# EAGLE schematic A10S-OLinuXino-MICRO_Rev_A (EAGLE 4.16)
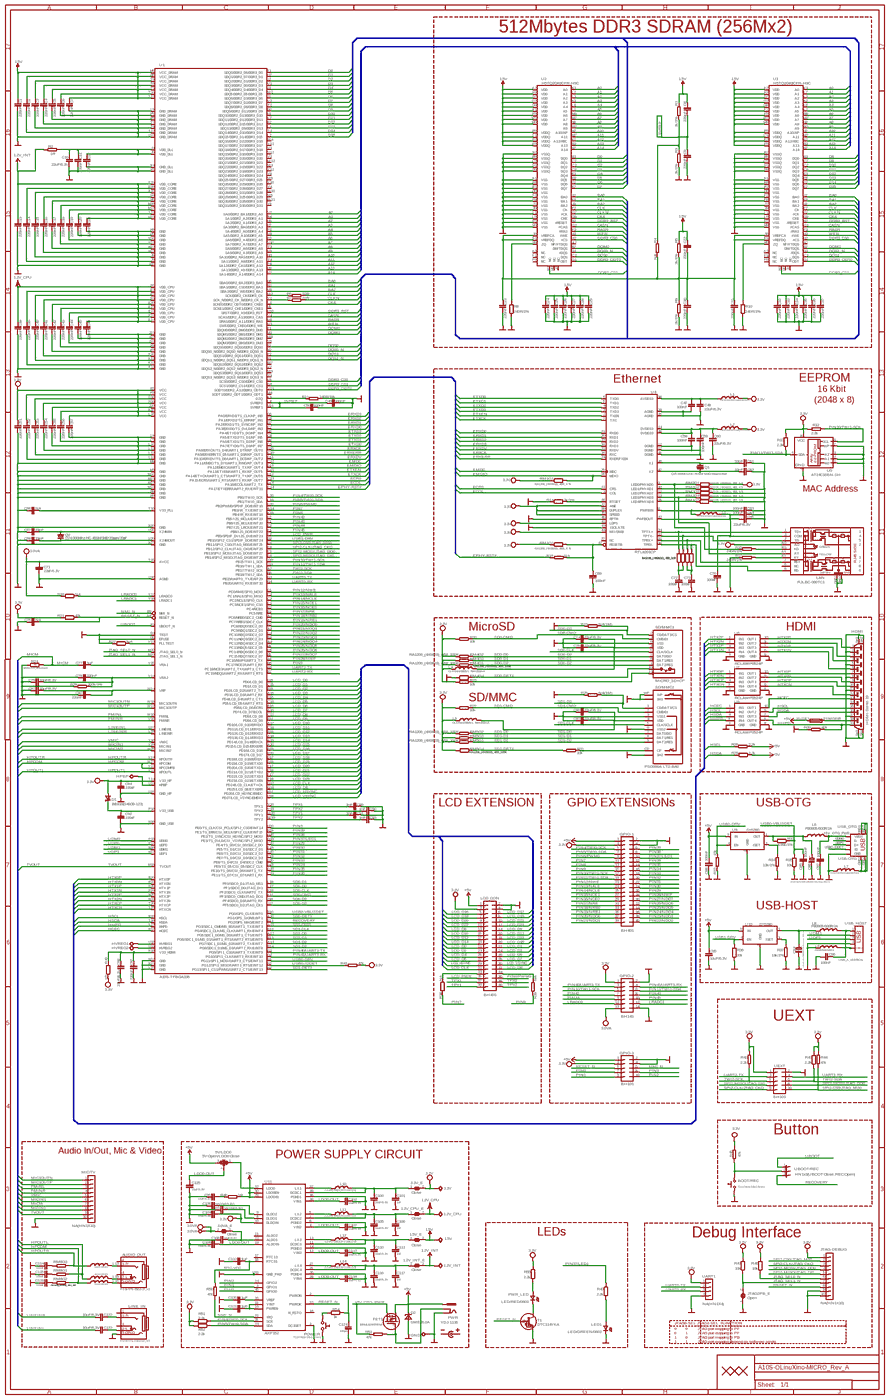
[diagram p0: schematic, sheet 1, overview]
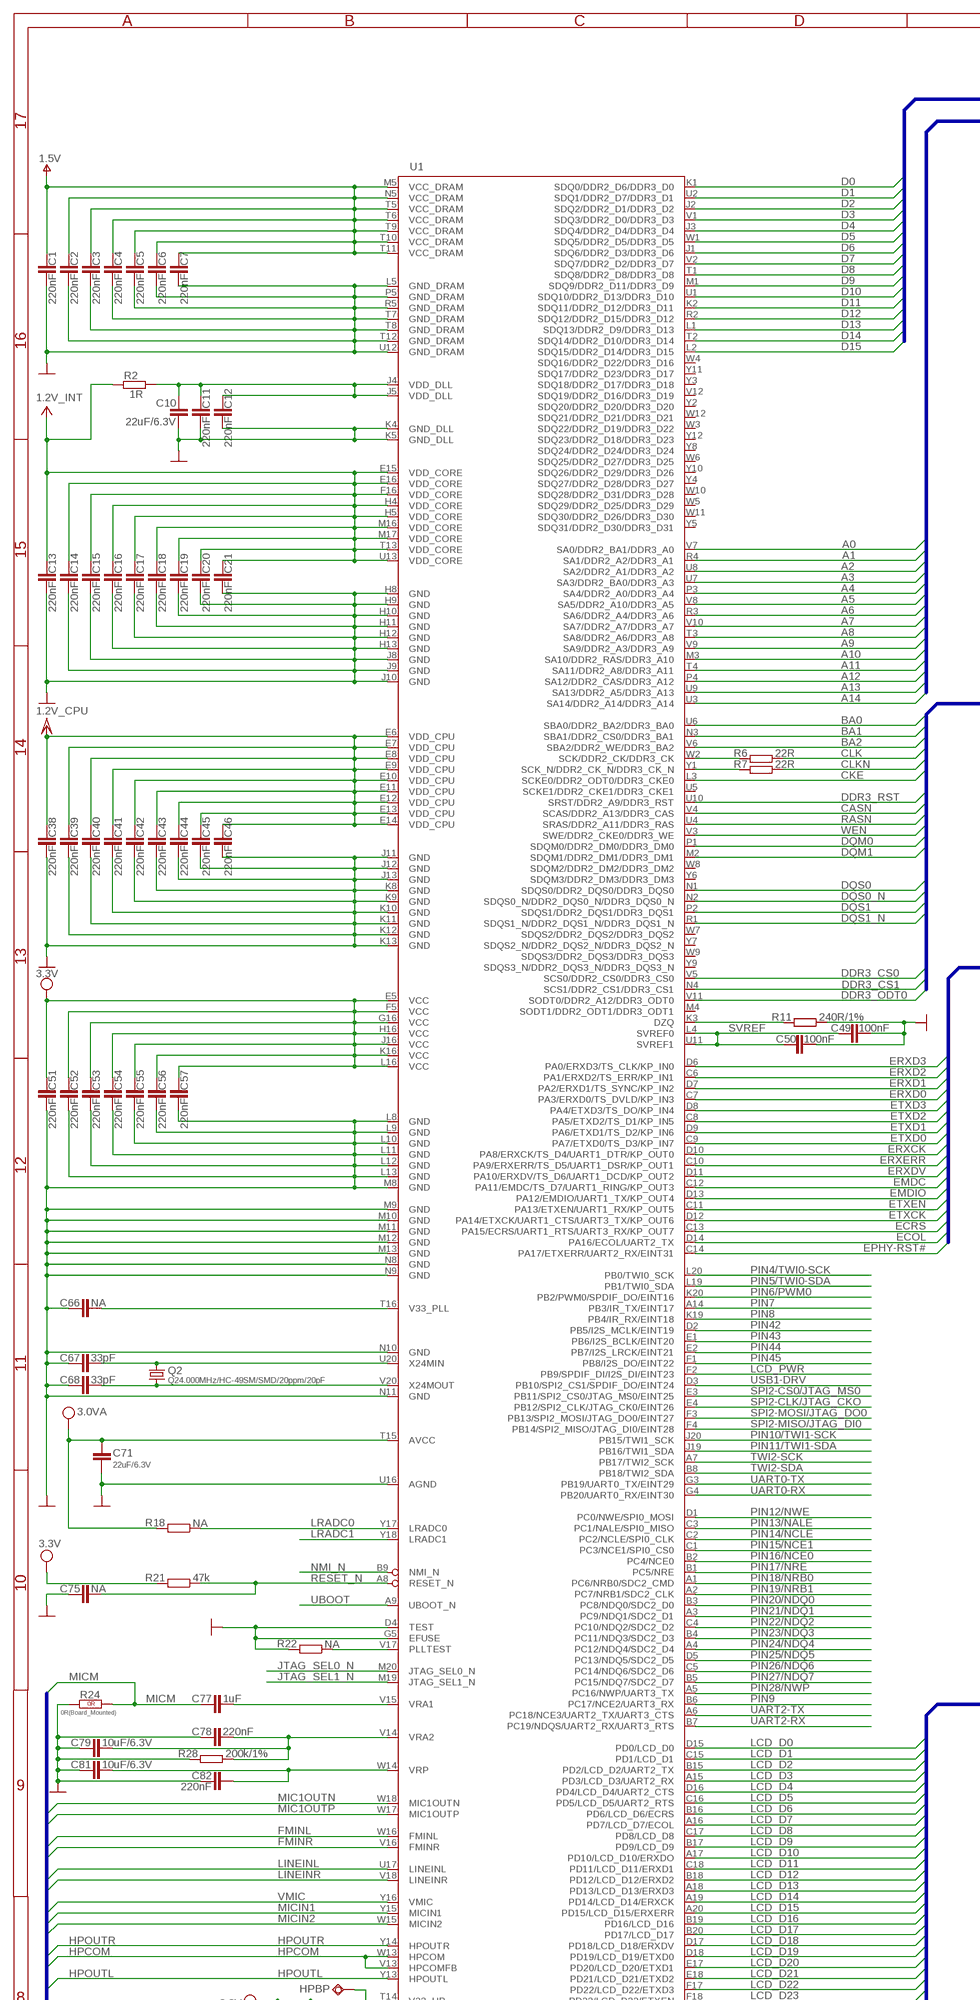
[diagram p1: schematic, sheet 1, part 1 of 4]
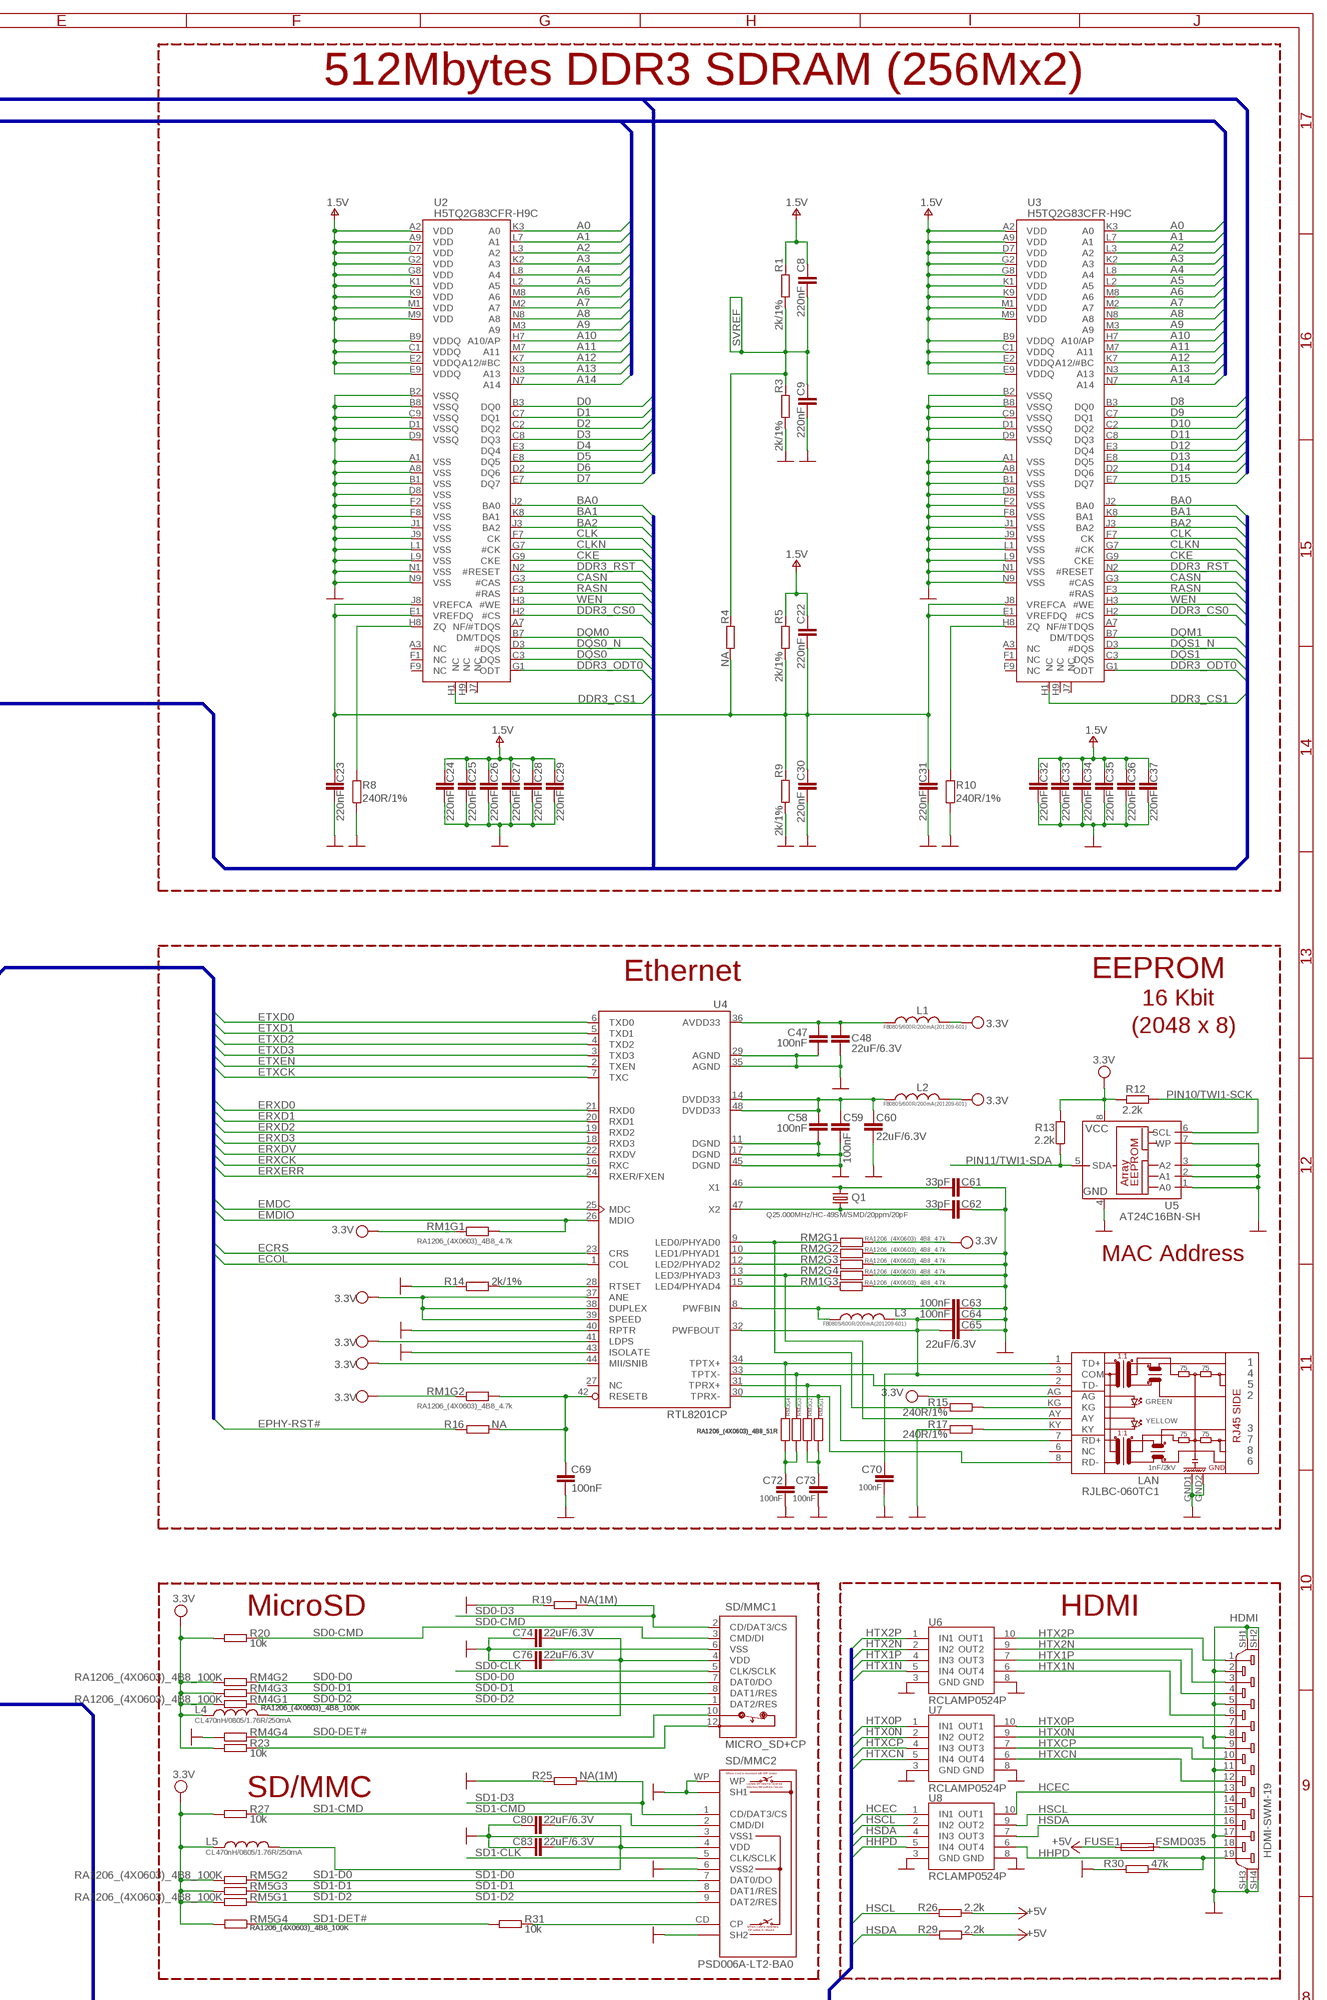
[diagram p2: schematic, sheet 1, part 2 of 4]
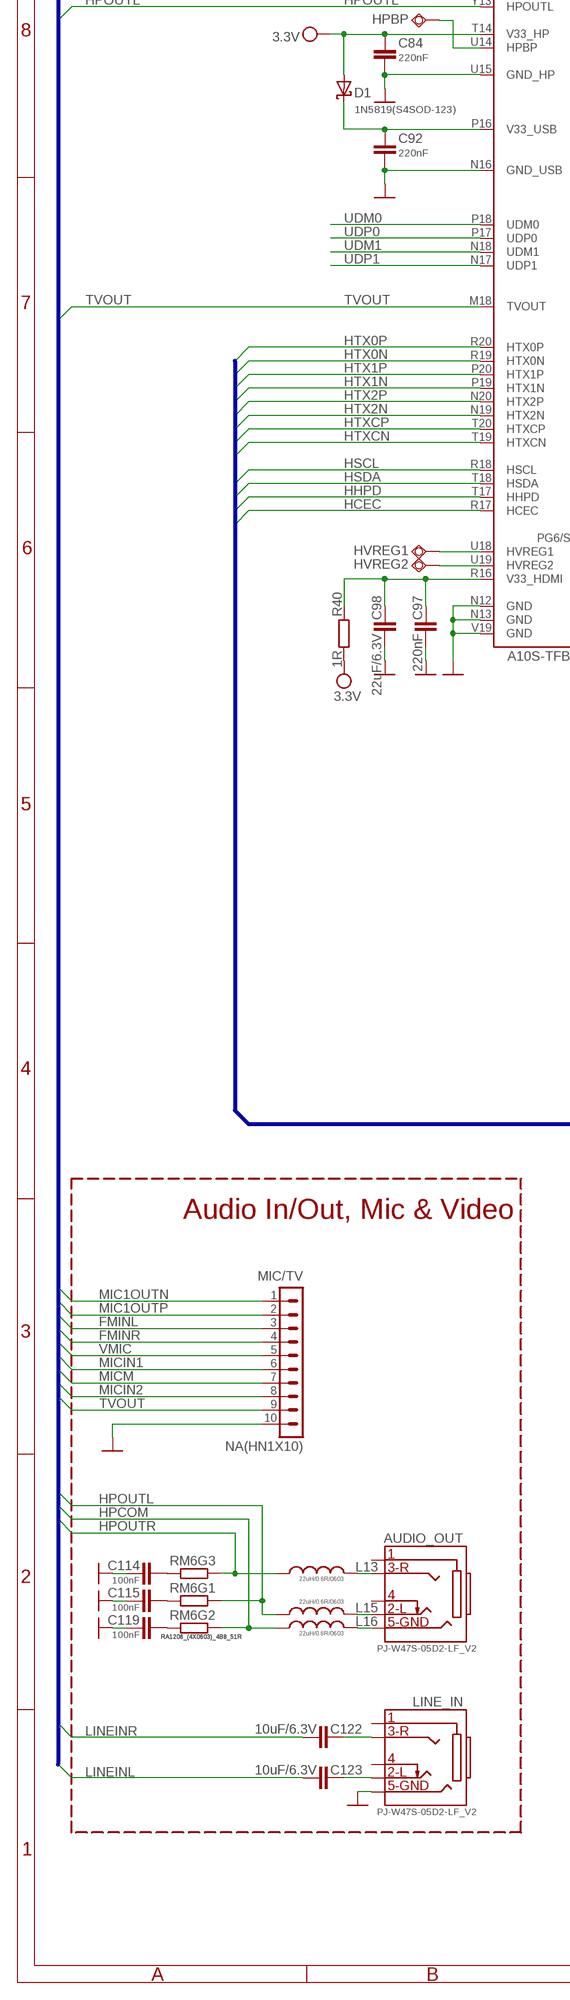
[diagram p3: schematic, sheet 1, part 3 of 4]
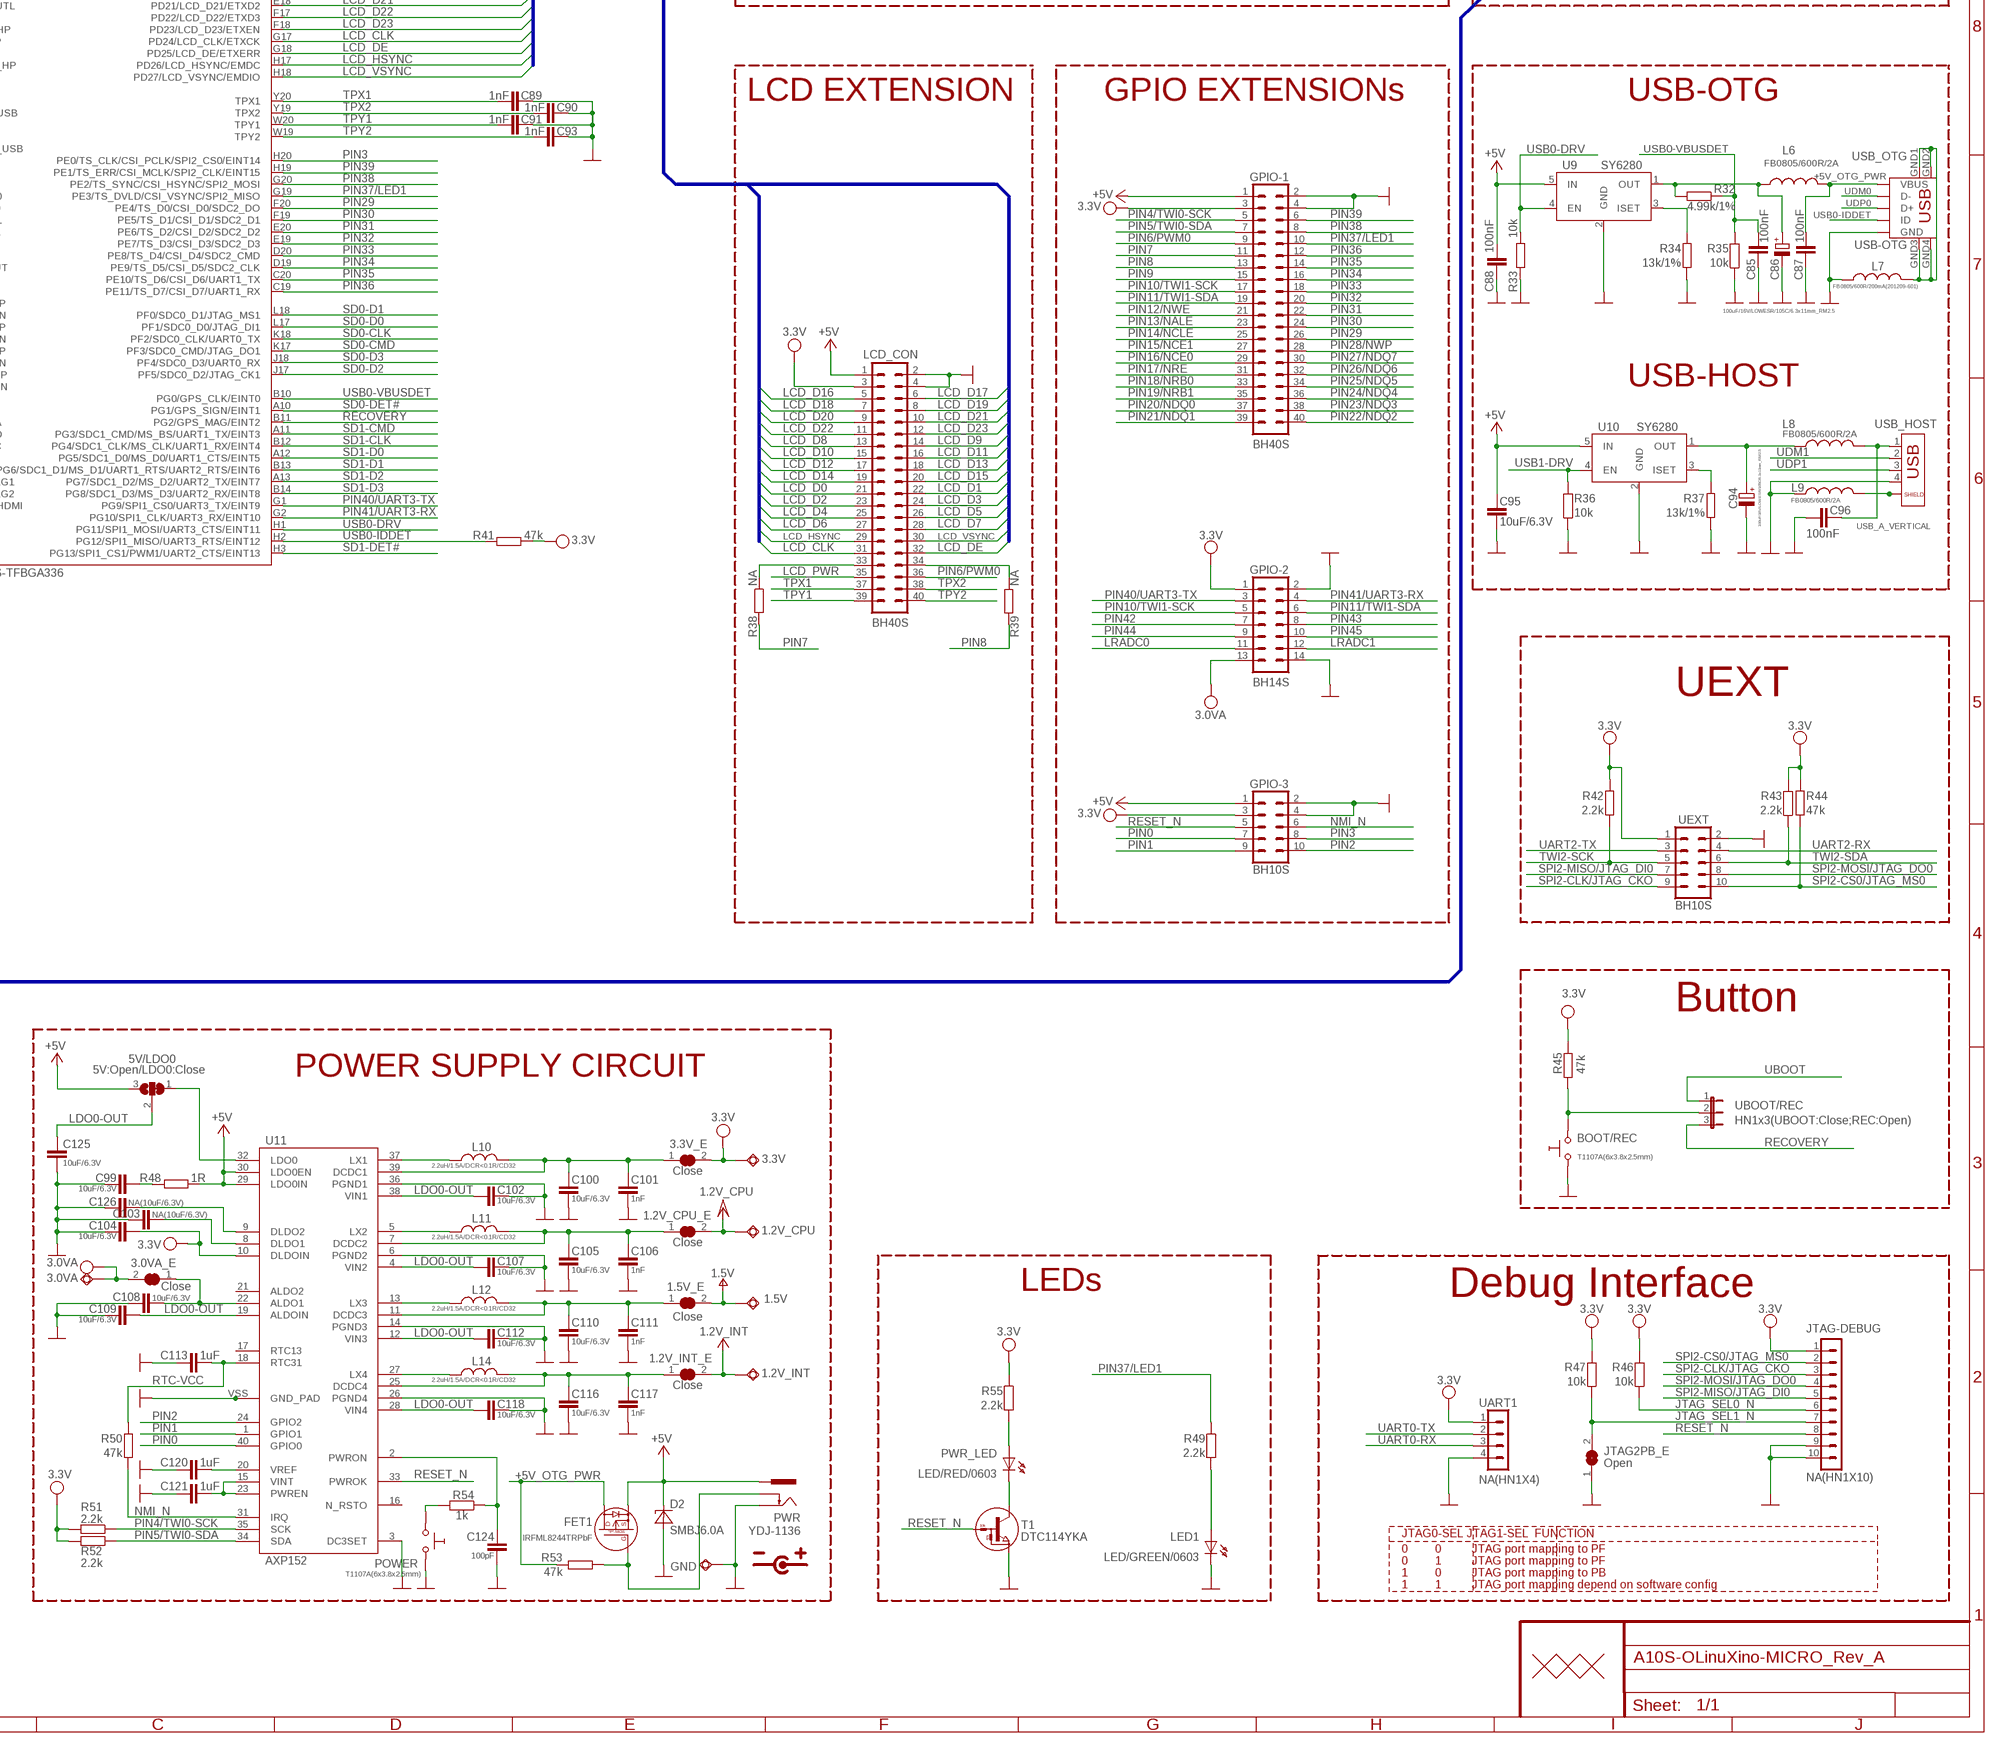
[diagram p4: schematic, sheet 1, part 4 of 4]

## Parts
1.2V_CPU  TESTPADTESTPAD_40-ROUND  [TESTPAD_40-ROUND]
1.2V_CPU_E  Close  SJSJ_1_SMALLER_CLOSE  [SJ_1_SMALLER_CLOSE]
1.2V_INT  TESTPADTESTPAD_40-ROUND  [TESTPAD_40-ROUND]
1.2V_INT_E  Close  SJSJ_1_SMALLER_CLOSE  [SJ_1_SMALLER_CLOSE]
1.5V  TESTPADTESTPAD_40-ROUND  [TESTPAD_40-ROUND]
1.5V_E  Close  SJSJ_1_SMALLER_CLOSE  [SJ_1_SMALLER_CLOSE]
3.0VA  TESTPADTESTPAD_40-ROUND  [TESTPAD_40-ROUND]
3.0VA_E  Close  SJSJ_1_SMALLER_CLOSE  [SJ_1_SMALLER_CLOSE]
3.3V  TESTPADTESTPAD_40-ROUND  [TESTPAD_40-ROUND]
3.3V_E  Close  SJSJ_1_SMALLER_CLOSE  [SJ_1_SMALLER_CLOSE]
5V/LDO0  5V:Open/LDO0:Close  SJ2W6  [SJ_2_SMALL_12_TIED]
AUDIO_OUT  PJ-W47S-05D2-LF_V2  AUDIO_JACK_5PINPJ-W47S-05D2-LF_V2  [PJ-W47S-05D2-LF_5PIN_V2]
BOOT/REC  T1107A(6x3.8x2.5mm)  SW-TAKT6  [SW-TAKT_6X3.5_SMD]
C1  220nF  C-EUC0603_DWS  [C0603_DWS]
C2  220nF  C-EUC0603_DWS  [C0603_DWS]
C3  220nF  C-EUC0603_DWS  [C0603_DWS]
C4  220nF  C-EUC0603_DWS  [C0603_DWS]
C5  220nF  C-EUC0603_DWS  [C0603_DWS]
C6  220nF  C-EUC0603_DWS  [C0603_DWS]
C7  220nF  C-EUC0603_DWS  [C0603_DWS]
C8  220nF  C-EUC0603_DWS  [C0603_DWS]
C9  220nF  C-EUC0603_DWS  [C0603_DWS]
C10  22uF/6.3V  C-EUC0603_DWS  [C0603_DWS]
C11  220nF  C-EUC0603_DWS  [C0603_DWS]
C12  220nF  C-EUC0603_DWS  [C0603_DWS]
C13  220nF  C-EUC0603_DWS  [C0603_DWS]
C14  220nF  C-EUC0603_DWS  [C0603_DWS]
C15  220nF  C-EUC0603_DWS  [C0603_DWS]
C16  220nF  C-EUC0603_DWS  [C0603_DWS]
C17  220nF  C-EUC0603_DWS  [C0603_DWS]
C18  220nF  C-EUC0603_DWS  [C0603_DWS]
C19  220nF  C-EUC0603_DWS  [C0603_DWS]
C20  220nF  C-EUC0603_DWS  [C0603_DWS]
C21  220nF  C-EUC0603_DWS  [C0603_DWS]
C22  220nF  C-EUC0603_DWS  [C0603_DWS]
C23  220nF  C-EUC0603_DWS  [C0603_DWS]
C24  220nF  C-EUC0603_DWS  [C0603_DWS]
C25  220nF  C-EUC0603_DWS  [C0603_DWS]
C26  220nF  C-EUC0603_DWS  [C0603_DWS]
C27  220nF  C-EUC0603_DWS  [C0603_DWS]
C28  220nF  C-EUC0603_DWS  [C0603_DWS]
C29  220nF  C-EUC0603_DWS  [C0603_DWS]
C30  220nF  C-EUC0603_DWS  [C0603_DWS]
C31  220nF  C-EUC0603_DWS  [C0603_DWS]
C32  220nF  C-EUC0603_DWS  [C0603_DWS]
C33  220nF  C-EUC0603_DWS  [C0603_DWS]
C34  220nF  C-EUC0603_DWS  [C0603_DWS]
C35  220nF  C-EUC0603_DWS  [C0603_DWS]
C36  220nF  C-EUC0603_DWS  [C0603_DWS]
C37  220nF  C-EUC0603_DWS  [C0603_DWS]
C38  220nF  C-EUC0603_DWS  [C0603_DWS]
C39  220nF  C-EUC0603_DWS  [C0603_DWS]
C40  220nF  C-EUC0603_DWS  [C0603_DWS]
C41  220nF  C-EUC0603_DWS  [C0603_DWS]
C42  220nF  C-EUC0603_DWS  [C0603_DWS]
C43  220nF  C-EUC0603_DWS  [C0603_DWS]
C44  220nF  C-EUC0603_DWS  [C0603_DWS]
C45  220nF  C-EUC0603_DWS  [C0603_DWS]
C46  220nF  C-EUC0603_DWS  [C0603_DWS]
C47  100nF  C-EUC0603_DWS  [C0603_DWS]
C48  22uF/6.3V  C-EUC0603_DWS  [C0603_DWS]
C49  100nF  C-EUC0603_DWS  [C0603_DWS]
C50  100nF  C-EUC0603_DWS  [C0603_DWS]
C51  220nF  C-EUC0603_DWS  [C0603_DWS]
C52  220nF  C-EUC0603_DWS  [C0603_DWS]
C53  220nF  C-EUC0603_DWS  [C0603_DWS]
C54  220nF  C-EUC0603_DWS  [C0603_DWS]
C55  220nF  C-EUC0603_DWS  [C0603_DWS]
C56  220nF  C-EUC0603_DWS  [C0603_DWS]
C57  220nF  C-EUC0603_DWS  [C0603_DWS]
C58  100nF  C-EUC0603_DWS  [C0603_DWS]
C59  100nF  C-EUC0603_DWS  [C0603_DWS]
C60  22uF/6.3V  C-EUC0603_DWS  [C0603_DWS]
C61  33pF  C-EUC0603_DWS  [C0603_DWS]
C62  33pF  C-EUC0603_DWS  [C0603_DWS]
C63  100nF  C-EUC0603_DWS  [C0603_DWS]
C64  100nF  C-EUC0603_DWS  [C0603_DWS]
C65  22uF/6.3V  C-EUC0603_DWS  [C0603_DWS]
C66  NA  C-EUC0603_DWS  [C0603_DWS]
C67  33pF  C-EUC0603_DWS  [C0603_DWS]
C68  33pF  C-EUC0603_DWS  [C0603_DWS]
C69  100nF  C-EUC0603_DWS  [C0603_DWS]
C70  100nF  C-EUC0603_DWS  [C0603_DWS]
C71  22uF/6.3V  C-EUC0603_DWS  [C0603_DWS]
C72  100nF  C-EUC0603_DWS  [C0603_DWS]
C73  100nF  C-EUC0603_DWS  [C0603_DWS]
C74  22uF/6.3V  C-EUC0603_DWS  [C0603_DWS]
C75  NA  C-EUC0603_DWS  [C0603_DWS]
C76  22uF/6.3V  C-EUC0603_DWS  [C0603_DWS]
C77  1uF  C-EUC0603_DWS  [C0603_DWS]
C78  220nF  C-EUC0603_DWS  [C0603_DWS]
C79  10uF/6.3V  C-EUC0603_DWS  [C0603_DWS]
C80  22uF/6.3V  C-EUC0603_DWS  [C0603_DWS]
C81  10uF/6.3V  C-EUC0603_DWS  [C0603_DWS]
C82  220nF  C-EUC0603_DWS  [C0603_DWS]
C83  22uF/6.3V  C-EUC0603_DWS  [C0603_DWS]
C84  220nF  C-EUC0603_DWS  [C0603_DWS]
C85  100nF  C-EUC0603_DWS  [C0603_DWS]
C86  100uF/16V/LOWESR/105C/6.3x11mm_RM2.5  CPOL-EUE2.5-6.3  [E2,5-6,3]
C87  100nF  C-EUC0603_DWS  [C0603_DWS]
C88  100nF  C-EUC0603_DWS  [C0603_DWS]
C89  1nF  C-EUC0603_DWS  [C0603_DWS]
C90  1nF  C-EUC0603_DWS  [C0603_DWS]
C91  1nF  C-EUC0603_DWS  [C0603_DWS]
C92  220nF  C-EUC0603_DWS  [C0603_DWS]
C93  1nF  C-EUC0603_DWS  [C0603_DWS]
C94  100uF/16V/LOWESR/105C/6.3x11mm_RM2.5  CPOL-EUE2.5-6.3  [E2,5-6,3]
C95  10uF/6.3V  C-EUC0603_DWS  [C0603_DWS]
C96  100nF  C-EUC0603_DWS  [C0603_DWS]
C97  220nF  C-EUC0603_DWS  [C0603_DWS]
C98  22uF/6.3V  C-EUC0603_DWS  [C0603_DWS]
C99  10uF/6.3V  C-EUC0603_DWS  [C0603_DWS]
C100  10uF/6.3V  C-EUC0603_DWS  [C0603_DWS]
C101  1nF  C-EUC0603_DWS  [C0603_DWS]
C102  10uF/6.3V  C-EUC0603_DWS  [C0603_DWS]
C103  NA(10uF/6.3V)  C-EUC0603_DWS  [C0603_DWS]
C104  10uF/6.3V  C-EUC0603_DWS  [C0603_DWS]
C105  10uF/6.3V  C-EUC0603_DWS  [C0603_DWS]
C106  1nF  C-EUC0603_DWS  [C0603_DWS]
C107  10uF/6.3V  C-EUC0603_DWS  [C0603_DWS]
C108  10uF/6.3V  C-EUC0603_DWS  [C0603_DWS]
C109  10uF/6.3V  C-EUC0603_DWS  [C0603_DWS]
C110  10uF/6.3V  C-EUC0603_DWS  [C0603_DWS]
C111  1nF  C-EUC0603_DWS  [C0603_DWS]
C112  10uF/6.3V  C-EUC0603_DWS  [C0603_DWS]
C113  1uF  C-EUC0603_DWS  [C0603_DWS]
C114  100nF  C-EUC0603_DWS  [C0603_DWS]
C115  100nF  C-EUC0603_DWS  [C0603_DWS]
C116  10uF/6.3V  C-EUC0603_DWS  [C0603_DWS]
C117  1nF  C-EUC0603_DWS  [C0603_DWS]
C118  10uF/6.3V  C-EUC0603_DWS  [C0603_DWS]
C119  100nF  C-EUC0603_DWS  [C0603_DWS]
C120  1uF  C-EUC0603_DWS  [C0603_DWS]
C121  1uF  C-EUC0603_DWS  [C0603_DWS]
C122  10uF/6.3V  C-EUC0603_DWS  [C0603_DWS]
C123  10uF/6.3V  C-EUC0603_DWS  [C0603_DWS]
C124  100pF  C-EUC0603_DWS  [C0603_DWS]
C125  10uF/6.3V  C-EUC0603_DWS  [C0603_DWS]
C126  NA(10uF/6.3V)  C-EUC0603_DWS  [C0603_DWS]
D1  1N5819(S4SOD-123)  SCHOTKKY7.62SS-1N5819(S4SOD-123)  [SOD-123]
D2  SMBJ6.0A  SMBJ16A  [DO214AA]
FET1  IRFML8244TRPbF  P-MOS+DIODIRLML6402  [SOT23]
FUSE1  FSMD035  FUSE  [1206]
GND  TESTPADTESTPAD_40-ROUND  [TESTPAD_40-ROUND]
GPIO-1  BH40S  ML40-GBH-254-SMT-40  [ML40-MALE(GBH-254-SMT-40)]
GPIO-2  BH14S  ML14MD  [ML14_S]
GPIO-3  BH10S  ML10MD  [ML10_S]
HDMI  HDMI-SWM-19  HDMI-MC34931HDMI-SWM-19  [HDMI-SWM-19]
HPBP  TESTPADTESTPAD_40-ROUND  [TESTPAD_40-ROUND]
HVREG1  TESTPADTESTPAD_40-ROUND  [TESTPAD_40-ROUND]
HVREG2  TESTPADTESTPAD_40-ROUND  [TESTPAD_40-ROUND]
JTAG2PB_E  Open  SJSJ_SMALLER  [SJ_1_SMALLER]
JTAG-DEBUG  NA(HN1X10)  CON10HN1X10  [HN1X10]
L1  FB0805/600R/200mA(201209-601)  L-USL0805_5MIL_DWS  [L0805_5MIL_DWS]
L2  FB0805/600R/200mA(201209-601)  L-USL0805_5MIL_DWS  [L0805_5MIL_DWS]
L3  FB0805/600R/200mA(201209-601)  L-USL0805_5MIL_DWS  [L0805_5MIL_DWS]
L4  CL470nH/0805/1.76R/250mA  L-USL0805_5MIL_DWS  [L0805_5MIL_DWS]
L5  CL470nH/0805/1.76R/250mA  L-USL0805_5MIL_DWS  [L0805_5MIL_DWS]
L6  FB0805/600R/2A  L-USL0805_5MIL_DWS  [L0805_5MIL_DWS]
L7  FB0805/600R/200mA(201209-601)  L-USL0805_5MIL_DWS  [L0805_5MIL_DWS]
L8  FB0805/600R/2A  L-USL0805_5MIL_DWS  [L0805_5MIL_DWS]
L9  FB0805/600R/2A  L-USL0805_5MIL_DWS  [L0805_5MIL_DWS]
L10  2.2uH/1.5A/DCR<0.1R/CD32  L-CD32  [CD32]
L11  2.2uH/1.5A/DCR<0.1R/CD32  L-CD32  [CD32]
L12  2.2uH/1.5A/DCR<0.1R/CD32  L-CD32  [CD32]
L13  22uH/0.6R/0603  L-USL0805_5MIL_DWS  [L0805_5MIL_DWS]
L14  2.2uH/1.5A/DCR<0.1R/CD32  L-CD32  [CD32]
L15  22uH/0.6R/0603  L-USL0805_5MIL_DWS  [L0805_5MIL_DWS]
L16  22uH/0.6R/0603  L-USL0805_5MIL_DWS  [L0805_5MIL_DWS]
LAN  RJLBC-060TC1  RJLBC-060TC1_GND  [RJLBC-060TC1]
LCD_CON  BH40S  ML40-GBH-254-SMT-40  [ML40-MALE(GBH-254-SMT-40)]
LED1  LED/GREEN/0603  LED0603DWS  [LED-0603]
LINE_IN  PJ-W47S-05D2-LF_V2  AUDIO_JACK_5PINPJ-W47S-05D2-LF_V2  [PJ-W47S-05D2-LF_5PIN_V2]
MIC/TV  NA(HN1X10)  CON10HN1X10  [HN1X10]
POWER  T1107A(6x3.8x2.5mm)  SW-TAKT6  [SW-TAKT_6X3.5_SMD]
PWR  YDJ-1136  PWR-JAKPWR_JACK_UNI_MILLING  [PWR_JACK_UNI_MILLING]
PWR_LED  LED/RED/0603  LED0603DWS  [LED-0603]
Q1  Q25.000MHz/HC-49SM/SMD/20ppm/20pF  HC49/S1  [HC49/SMD2_THIN]
Q2  Q24.000MHz/HC-49SM/SMD/20ppm/20pF  HC49/S1  [HC49/SMD2_THIN]
R1  2k/1%  R-EU_R0603_5MIL_DWS  [R0603_5MIL_DWS]
R2  1R  R-EU_R0603_5MIL_DWS  [R0603_5MIL_DWS]
R3  2k/1%  R-EU_R0603_5MIL_DWS  [R0603_5MIL_DWS]
R4  NA  R-EU_R0603_5MIL_DWS  [R0603_5MIL_DWS]
R5  2k/1%  R-EU_R0603_5MIL_DWS  [R0603_5MIL_DWS]
R6  22R  R-EU_R0603_5MIL_DWS  [R0603_5MIL_DWS]
R7  22R  R-EU_R0603_5MIL_DWS  [R0603_5MIL_DWS]
R8  240R/1%  R-EU_R0603_5MIL_DWS  [R0603_5MIL_DWS]
R9  2k/1%  R-EU_R0603_5MIL_DWS  [R0603_5MIL_DWS]
R10  240R/1%  R-EU_R0603_5MIL_DWS  [R0603_5MIL_DWS]
R11  240R/1%  R-EU_R0603_5MIL_DWS  [R0603_5MIL_DWS]
R12  2.2k  R-EU_R0603_5MIL_DWS  [R0603_5MIL_DWS]
R13  2.2k  R-EU_R0603_5MIL_DWS  [R0603_5MIL_DWS]
R14  2k/1%  R-EU_R0603_5MIL_DWS  [R0603_5MIL_DWS]
R15  240R/1%  R-EU_R0603_5MIL_DWS  [R0603_5MIL_DWS]
R16  NA  R-EU_R0603_5MIL_DWS  [R0603_5MIL_DWS]
R17  240R/1%  R-EU_R0603_5MIL_DWS  [R0603_5MIL_DWS]
R18  NA  R-EU_R0603_5MIL_DWS  [R0603_5MIL_DWS]
R19  NA(1M)  R-EU_R0603_5MIL_DWS  [R0603_5MIL_DWS]
R20  10k  R-EU_R0603_5MIL_DWS  [R0603_5MIL_DWS]
R21  47k  R-EU_R0603_5MIL_DWS  [R0603_5MIL_DWS]
R22  NA  R-EU_R0603_5MIL_DWS  [R0603_5MIL_DWS]
R23  10k  R-EU_R0603_5MIL_DWS  [R0603_5MIL_DWS]
R24  0R(Board_Mounted)  R_0R0R(NA)  [0603_0R]
R25  NA(1M)  R-EU_R0603_5MIL_DWS  [R0603_5MIL_DWS]
R26  2.2k  R-EU_R0603_5MIL_DWS  [R0603_5MIL_DWS]
R27  10k  R-EU_R0603_5MIL_DWS  [R0603_5MIL_DWS]
R28  200k/1%  R-EU_R0603_5MIL_DWS  [R0603_5MIL_DWS]
R29  2.2k  R-EU_R0603_5MIL_DWS  [R0603_5MIL_DWS]
R30  47k  R-EU_R0603_5MIL_DWS  [R0603_5MIL_DWS]
R31  10k  R-EU_R0603_5MIL_DWS  [R0603_5MIL_DWS]
R32  4.99k/1%  R-EU_R0603_5MIL_DWS  [R0603_5MIL_DWS]
R33  10k  R-EU_R0603_5MIL_DWS  [R0603_5MIL_DWS]
R34  13k/1%  R-EU_R0603_5MIL_DWS  [R0603_5MIL_DWS]
R35  10k  R-EU_R0603_5MIL_DWS  [R0603_5MIL_DWS]
R36  10k  R-EU_R0603_5MIL_DWS  [R0603_5MIL_DWS]
R37  13k/1%  R-EU_R0603_5MIL_DWS  [R0603_5MIL_DWS]
R38  NA  R-EU_R0603_5MIL_DWS  [R0603_5MIL_DWS]
R39  NA  R-EU_R0603_5MIL_DWS  [R0603_5MIL_DWS]
R40  1R  R-EU_R0603_5MIL_DWS  [R0603_5MIL_DWS]
R41  47k  R-EU_R0603_5MIL_DWS  [R0603_5MIL_DWS]
R42  2.2k  R-EU_R0603_5MIL_DWS  [R0603_5MIL_DWS]
R43  2.2k  R-EU_R0603_5MIL_DWS  [R0603_5MIL_DWS]
R44  47k  R-EU_R0603_5MIL_DWS  [R0603_5MIL_DWS]
R45  47k  R-EU_R0603_5MIL_DWS  [R0603_5MIL_DWS]
R46  10k  R-EU_R0603_5MIL_DWS  [R0603_5MIL_DWS]
R47  10k  R-EU_R0603_5MIL_DWS  [R0603_5MIL_DWS]
R48  1R  R-EU_R0603_5MIL_DWS  [R0603_5MIL_DWS]
R49  2.2k  R-EU_R0603_5MIL_DWS  [R0603_5MIL_DWS]
R50  47k  R-EU_R0603_5MIL_DWS  [R0603_5MIL_DWS]
R51  2.2k  R-EU_R0603_5MIL_DWS  [R0603_5MIL_DWS]
R52  2.2k  R-EU_R0603_5MIL_DWS  [R0603_5MIL_DWS]
R53  47k  R-EU_R0603_5MIL_DWS  [R0603_5MIL_DWS]
R54  1k  R-EU_R0603_5MIL_DWS  [R0603_5MIL_DWS]
R55  2.2k  R-EU_R0603_5MIL_DWS  [R0603_5MIL_DWS]
RM1  RA1206_(4X0603)_4B8_4.7k  R_MATRIX_4E  [R_MATRIX_4]
RM2  RA1206_(4X0603)_4B8_4.7k  R_MATRIX_4E  [R_MATRIX_4]
RM3  RA1206_(4X0603)_4B8_51R  R_MATRIX_4E  [R_MATRIX_4]
RM4  RA1206_(4X0603)_4B8_100K  R_MATRIX_4E  [R_MATRIX_4]
RM5  RA1206_(4X0603)_4B8_100K  R_MATRIX_4E  [R_MATRIX_4]
RM6  RA1206_(4X0603)_4B8_51R  R_MATRIX_4E  [R_MATRIX_4]
SD/MMC1  MICRO_SD+CP  MICRO_SD/MMC_CPMICRO  [TFR-MEM-CON]
SD/MMC2  PSD006A-LT2-BA0  SD_CARD_PSD006A-LT2-BA0  [SD_CARD]
T1  DTC114YKA  DIGITAL_TRANSISTORS-NPNDTC114YKA  [SOT-23]
U1  A10S-TFBGA336  [TFBGA336]
U2  H5TQ2G83CFR-H9C  [FBGA78]
U3  H5TQ2G83CFR-H9C  [FBGA78]
U4  RTL8201CP  [LQFP48]
U5  AT24C16BN-SH  24LCXX  [SO-08MN]
U6  RCLAMP0524P  [SLP2510P8]
U7  RCLAMP0524P  [SLP2510P8]
U8  RCLAMP0524P  [SLP2510P8]
U9  SY6280  [SOT23-5]
U10  SY6280  [SOT23-5]
U11  AXP152  [QFN40_5X5]
U15  FIDUCIAL1X2  [FIDUCIAL-1X2]
U16  FIDUCIAL1X2  [FIDUCIAL-1X2]
U17  FIDUCIAL1X2  [FIDUCIAL-1X2]
UART1  NA(HN1X4)  CON4HN1X4  [HN1X4]
UBOOT/REC  HN1x3(UBOOT:Close;REC:Open)  JP2E  [JP2]
UEXT  BH10S  ML10MD  [ML10_S]
USB_HOST  USB_A_VERTICAL  USB_SHIELDUSB_A_VERTICAL  [USB_A_VERTICAL_PTH]
USB_OTG  USB-OTG  MINI_USB9  [USB_MINI_9PIN]

## Nets
+5V: 5V/LDO0.3 C88.1 C95.1 D2.C FET1.2(S) FUSE1.1 GPIO-1.1 GPIO-3.1 LCD_CON.1 PWR.+ R26.1 R29.1 R48.2 U9.5(IN) U10.5(IN) U11.29(LDO0IN) U11.30(LDO0EN)
+5V_OTG_PWR: C87.1 FET1.3(D) L6.1 R53.2 USB_OTG.VBUS
A0: U1.V7(SA0/DDR2_BA1/DDR3_A0) U2.K3(A0) U3.K3(A0)
A1: U1.R4(SA1/DDR2_A2/DDR3_A1) U2.L7(A1) U3.L7(A1)
A2: U1.U8(SA2/DDR2_A1/DDR3_A2) U2.L3(A2) U3.L3(A2)
A3: U1.U7(SA3/DDR2_BA0/DDR3_A3) U2.K2(A3) U3.K2(A3)
A4: U1.P3(SA4/DDR2_A0/DDR3_A4) U2.L8(A4) U3.L8(A4)
A5: U1.V8(SA5/DDR2_A10/DDR3_A5) U2.L2(A5) U3.L2(A5)
A6: U1.R3(SA6/DDR2_A4/DDR3_A6) U2.M8(A6) U3.M8(A6)
A7: U1.V10(SA7/DDR2_A7/DDR3_A7) U2.M2(A7) U3.M2(A7)
A8: U1.T3(SA8/DDR2_A6/DDR3_A8) U2.N8(A8) U3.N8(A8)
A9: U1.V9(SA9/DDR2_A3/DDR3_A9) U2.M3(A9) U3.M3(A9)
A10: U1.M3(SA10/DDR2_RAS/DDR3_A10) U2.H7(A10/AP) U3.H7(A10/AP)
A11: U1.T4(SA11/DDR2_A8/DDR3_A11) U2.M7(A11) U3.M7(A11)
A12: U1.P4(SA12/DDR2_CAS/DDR3_A12) U2.K7(A12/#BC) U3.K7(A12/#BC)
A13: U1.U9(SA13/DDR2_A5/DDR3_A13) U2.N3(A13) U3.N3(A13)
A14: U1.U3(SA14/DDR2_A14/DDR3_A14) U2.N7(A14) U3.N7(A14)
AVDD33: C47.2 C48.2 L1.1 U4.36(AVDD33)
BA0: U1.U6(SBA0/DDR2_BA2/DDR3_BA0) U2.J2(BA0) U3.J2(BA0)
BA1: U1.N3(SBA1/DDR2_CS0/DDR3_BA1) U2.K8(BA1) U3.K8(BA1)
BA2: U1.V6(SBA2/DDR2_WE/DDR3_BA2) U2.J3(BA2) U3.J3(BA2)
CASN: U1.V4(SCAS/DDR2_A13/DDR3_CAS) U2.G3(#CAS) U3.G3(#CAS)
CKE: U1.L3(SCKE0/DDR2_ODT0/DDR3_CKE0) U2.G9(CKE) U3.G9(CKE)
CLK: R6.1 U2.F7(CK) U3.F7(CK)
CLKN: R7.1 U2.G7(#CK) U3.G7(#CK)
D0: U1.K1(SDQ0/DDR2_D6/DDR3_D0) U2.B3(DQ0)
D1: U1.U2(SDQ1/DDR2_D7/DDR3_D1) U2.C7(DQ1)
D2: U1.J2(SDQ2/DDR2_D1/DDR3_D2) U2.C2(DQ2)
D3: U1.V1(SDQ3/DDR2_D0/DDR3_D3) U2.C8(DQ3)
D4: U1.J3(SDQ4/DDR2_D4/DDR3_D4) U2.E3(DQ4)
D5: U1.W1(SDQ5/DDR2_D5/DDR3_D5) U2.E8(DQ5)
D6: U1.J1(SDQ6/DDR2_D3/DDR3_D6) U2.D2(DQ6)
D7: U1.V2(SDQ7/DDR2_D2/DDR3_D7) U2.E7(DQ7)
D8: U1.T1(SDQ8/DDR2_D8/DDR3_D8) U3.B3(DQ0)
D9: U1.M1(SDQ9/DDR2_D11/DDR3_D9) U3.C7(DQ1)
D10: U1.U1(SDQ10/DDR2_D13/DDR3_D10) U3.C2(DQ2)
D11: U1.K2(SDQ11/DDR2_D12/DDR3_D11) U3.C8(DQ3)
D12: U1.R2(SDQ12/DDR2_D15/DDR3_D12) U3.E3(DQ4)
D13: U1.L1(SDQ13/DDR2_D9/DDR3_D13) U3.E8(DQ5)
D14: U1.T2(SDQ14/DDR2_D10/DDR3_D14) U3.D2(DQ6)
D15: U1.L2(SDQ15/DDR2_D14/DDR3_D15) U3.E7(DQ7)
DDR3_CK: R6.2 U1.W2(SCK/DDR2_CK/DDR3_CK)
DDR3_CK_N: R7.2 U1.Y1(SCK_N/DDR2_CK_N/DDR3_CK_N)
DDR3_CS0: U1.V5(SCS0/DDR2_CS0/DDR3_CS0) U2.H2(#CS) U3.H2(#CS)
DDR3_CS1: U1.N4(SCS1/DDR2_CS1/DDR3_CS1) U2.H1(NC) U3.H1(NC)
DDR3_ODT0: U1.V11(SODT0/DDR2_A12/DDR3_ODT0) U2.G1(ODT) U3.G1(ODT)
DDR3_RST: U1.U10(SRST/DDR2_A9/DDR3_RST) U2.N2(#RESET) U3.N2(#RESET)
DQM0: U1.P1(SDQM0/DDR2_DM0/DDR3_DM0) U2.B7(DM/TDQS)
DQM1: U1.M2(SDQM1/DDR2_DM1/DDR3_DM1) U3.B7(DM/TDQS)
DQS0: U1.N1(SDQS0/DDR2_DQS0/DDR3_DQS0) U2.C3(DQS)
DQS0_N: U1.N2(SDQS0_N/DDR2_DQS0_N/DDR3_DQS0_N) U2.D3(#DQS)
DQS1: U1.P2(SDQS1/DDR2_DQS1/DDR3_DQS1) U3.C3(DQS)
DQS1_N: U1.R1(SDQS1_N/DDR2_DQS1_N/DDR3_DQS1_N) U3.D3(#DQS)
DRAM-REF: C22.2 C23.2 C30.2 C31.2 R4.1 R5.1 R9.2 U2.E1(VREFDQ) U2.J8(VREFCA) U3.E1(VREFDQ) U3.J8(VREFCA)
DVDD33 [PWR]: C58.2 C59.2 C60.2 L2.1 U4.14(DVDD33) U4.48(DVDD33)
DZQ: R11.2 U1.K3(DZQ)
ECOL: U1.D14(PA16/ECOL/UART2_TX) U4.1(COL)
ECRS: U1.C13(PA15/ECRS/UART1_RTS/UART3_RX/KP_OUT7) U4.23(CRS)
EMDC: U1.C12(PA11/EMDC/TS_D7/UART1_RING/KP_OUT3) U4.25(MDC)
EMDIO: RM1.1.2 U1.D13(PA12/EMDIO/UART1_TX/KP_OUT4) U4.26(MDIO)
EPHY-RST#: R16.1 U1.C14(PA17/ETXERR/UART2_RX/EINT31)
ERXCK: U1.D10(PA8/ERXCK/TS_D4/UART1_DTR/KP_OUT0) U4.16(RXC)
ERXD0: U1.C7(PA3/ERXD0/TS_DVLD/KP_IN3) U4.21(RXD0)
ERXD1: U1.D7(PA2/ERXD1/TS_SYNC/KP_IN2) U4.20(RXD1)
ERXD2: U1.C6(PA1/ERXD2/TS_ERR/KP_IN1) U4.19(RXD2)
ERXD3: U1.D6(PA0/ERXD3/TS_CLK/KP_IN0) U4.18(RXD3)
ERXDV: U1.D11(PA10/ERXDV/TS_D6/UART1_DCD/KP_OUT2) U4.22(RXDV)
ERXERR: U1.C10(PA9/ERXERR/TS_D5/UART1_DSR/KP_OUT1) U4.24(RXER/FXEN)
ETXCK: U1.D12(PA14/ETXCK/UART1_CTS/UART3_TX/KP_OUT6) U4.7(TXC)
ETXD0: U1.C9(PA7/ETXD0/TS_D3/KP_IN7) U4.6(TXD0)
ETXD1: U1.D9(PA6/ETXD1/TS_D2/KP_IN6) U4.5(TXD1)
ETXD2: U1.C8(PA5/ETXD2/TS_D1/KP_IN5) U4.4(TXD2)
ETXD3: U1.D8(PA4/ETXD3/TS_DO/KP_IN4) U4.3(TXD3)
ETXEN: U1.C11(PA13/ETXEN/UART1_RX/KP_OUT5) U4.2(TXEN)
FMINL: MIC/TV.3 U1.W16(FMINL)
FMINR: MIC/TV.4 U1.V16(FMINR)
GND [PWR]: BOOT/REC.P$1 C1.1 C2.1 C3.1 C4.1 C5.1 C6.1 C7.1 C9.1 C10.1 C11.1 C12.1 C13.1 C14.1 C15.1 C16.1 C17.1 C18.1 C19.1 C20.1 C21.1 C23.1 C24.1 C25.1 C26.1 C27.1 C28.1 C29.1 C30.1 C31.1 C32.1 C33.1 C34.1 C35.1 C36.1 C37.1 C38.1 C39.1 C40.1 C41.1 C42.1 C43.1 C44.1 C45.1 C46.1 C47.1 C48.1 C49.1 C50.1 C51.1 C52.1 C53.1 C54.1 C55.1 C56.1 C57.1 C58.1 C59.1 C60.1 C61.1 C62.1 C63.2 C64.2 C65.2 C66.1 C67.1 C68.1 C69.1 C70.1 C71.1 C72.1 C73.1 C74.1 C75.1 C76.1 C78.1 C79.1 C80.1 C81.1 C82.1 C83.1 C84.1 C85.2 C86.- C87.2 C88.2 C89.1 C90.1 C91.1 C92.1 C93.1 C94.- C95.2 C96.2 C97.2 C98.1 C99.2 C100.2 C101.2 C102.2 C103.2 C104.2 C105.2 C106.2 C107.2 C108.2 C109.2 C110.2 C111.2 C112.2 C113.2 C114.1 C115.1 C116.2 C117.2 C118.2 C119.1 C120.2 C121.2 C124.2 C125.2 C126.2 D2.A GND.1(PP) GPIO-1.2 GPIO-1.4 GPIO-2.2 GPIO-2.14 GPIO-3.2 GPIO-3.4 HDMI.2 HDMI.5 HDMI.8 HDMI.11 HDMI.17 HDMI.SH1 HDMI.SH2 HDMI.SH3 HDMI.SH4 JTAG2PB_E.1 JTAG-DEBUG.9 JTAG-DEBUG.10 L7.1 L9.1 LAN.GND1 LAN.GND2 LCD_CON.2 LCD_CON.4 LED1.C LINE_IN.5 MIC/TV.10 POWER.P$2 PWR.- R3.1 R8.1 R9.1 R10.1 R11.1 R14.1 R17.2 R19.2 R22.2 R24.1(1.1) R25.2 R28.2 R30.2 R33.1 R34.1 R35.1 R36.1 R37.1 RM1.3.2 RM2.2.1 RM2.3.1 RM2.4.1 RM4.4.1 SD/MMC1.6(VSS) SD/MMC2.3(VSS1) SD/MMC2.6(VSS2) SD/MMC2.SH1 SD/MMC2.SH2 SD/MMC2.WP T1.2(E) U1.D4(TEST) U1.G5(EFUSE) U1.H8(GND) U1.H9(GND) U1.H10(GND) U1.H11(GND) U1.H12(GND) U1.H13(GND) U1.J8(GND) U1.J9(GND) U1.J10(GND) U1.J11(GND) U1.J12(GND) U1.J13(GND) U1.K4(GND_DLL) U1.K5(GND_DLL) U1.K8(GND) U1.K9(GND) U1.K10(GND) U1.K11(GND) U1.K12(GND) U1.K13(GND) U1.L5(GND_DRAM) U1.L8(GND) U1.L9(GND) U1.L10(GND) U1.L11(GND) U1.L12(GND) U1.L13(GND) U1.M8(GND) U1.M9(GND) U1.M10(GND) U1.M11(GND) U1.M12(GND) U1.M13(GND) U1.N8(GND) U1.N9(GND) U1.N10(GND) U1.N11(GND) U1.N12(GND) U1.N13(GND) U1.N16(GND_USB) U1.P5(GND_DRAM) U1.R5(GND_DRAM) U1.T7(GND_DRAM) U1.T8(GND_DRAM) U1.T12(GND_DRAM) U1.U12(GND_DRAM) U1.U15(GND_HP) U1.U16(AGND) U1.V19(GND) U2.A1(VSS) U2.A8(VSS) U2.B1(VSS) U2.B2(VSSQ) U2.B8(VSSQ) U2.C9(VSSQ) U2.D1(VSSQ) U2.D8(VSS) U2.D9(VSSQ) U2.F2(VSS) U2.F8(VSS) U2.J1(VSS) U2.J9(VSS) U2.L1(VSS) U2.L9(VSS) U2.N1(VSS) U2.N9(VSS) U3.A1(VSS) U3.A8(VSS) U3.B1(VSS) U3.B2(VSSQ) U3.B8(VSSQ) U3.C9(VSSQ) U3.D1(VSSQ) U3.D8(VSS) U3.D9(VSSQ) U3.F2(VSS) U3.F8(VSS) U3.J1(VSS) U3.J9(VSS) U3.L1(VSS) U3.L9(VSS) U3.N1(VSS) U3.N9(VSS) U4.11(DGND) U4.17(DGND) U4.29(AGND) U4.35(AGND) U4.40(RPTR) U4.43(ISOLATE) U4.45(DGND) U5.1(A0) U5.2(A1) U5.3(A2) U5.4(GND) U5.7(WP) U6.3(GND) U6.8(GND) U7.3(GND) U7.8(GND) U8.3(GND) U8.8(GND) U9.2(GND) U10.2(GND) U11.3(DC3SET) U11.6(PGND2) U11.14(PGND3) U11.26(PGND4) U11.36(PGND1) U11.N1(GND_PAD) U11.N2(GND_PAD) U11.N3(GND_PAD) U11.N4(GND_PAD) U11.N5(GND_PAD) U11.N6(GND_PAD) U11.N7(GND_PAD) U11.N8(GND_PAD) U11.N9(GND_PAD) U11.N10(GND_PAD) U11.N11(GND_PAD) U11.N12(GND_PAD) U11.N13(GND_PAD) U11.N14(GND_PAD) U11.N15(GND_PAD) U11.N16(GND_PAD) U11.N17(GND_PAD) U11.VSS(GND_PAD) UART1.4 UEXT.2 USB_HOST.4 USB_OTG.GND
HCEC: HDMI.13 U1.R17(HCEC) U8.1(IN1) U8.10(OUT1)
HDMI_5V_SOURCE: FUSE1.2 HDMI.18
HHPD: HDMI.19 R30.1 U1.T17(HHPD) U8.5(IN4) U8.6(OUT4)
HPCOM: L16.1 RM6.2.2 U1.V13(HPCOMFB) U1.W13(HPCOM)
HPOUTL: L15.1 RM6.1.2 U1.Y13(HPOUTL)
HPOUTR: L13.1 RM6.3.2 U1.Y14(HPOUTR)
HSCL: HDMI.15 R26.2 U1.R18(HSCL) U8.2(IN2) U8.9(OUT2)
HSDA: HDMI.16 R29.2 U1.T18(HSDA) U8.4(IN3) U8.7(OUT3)
HTX0N: HDMI.9 U1.R19(HTX0N) U7.2(IN2) U7.9(OUT2)
HTX0P: HDMI.7 U1.R20(HTX0P) U7.1(IN1) U7.10(OUT1)
HTX1N: HDMI.6 U1.P19(HTX1N) U6.5(IN4) U6.6(OUT4)
HTX1P: HDMI.4 U1.P20(HTX1P) U6.4(IN3) U6.7(OUT3)
HTX2N: HDMI.3 U1.N19(HTX2N) U6.2(IN2) U6.9(OUT2)
HTX2P: HDMI.1 U1.N20(HTX2P) U6.1(IN1) U6.10(OUT1)
HTXCN: HDMI.12 U1.T19(HTXCN) U7.5(IN4) U7.6(OUT4)
HTXCP: HDMI.10 U1.T20(HTXCP) U7.4(IN3) U7.7(OUT3)
JTAG_SEL0_N: JTAG-DEBUG.6 R46.1 U1.M20(JTAG_SEL0_N)
JTAG_SEL1_N: JTAG2PB_E.2 JTAG-DEBUG.7 R47.1 U1.M19(JTAG_SEL1_N)
LCD_CLK: LCD_CON.31 U1.G17(PD24/LCD_CLK/ETXCK)
LCD_D0: LCD_CON.21 U1.D15(PD0/LCD_D0)
LCD_D1: LCD_CON.22 U1.C15(PD1/LCD_D1)
LCD_D2: LCD_CON.23 U1.B15(PD2/LCD_D2/UART2_TX)
LCD_D3: LCD_CON.24 U1.A15(PD3/LCD_D3/UART2_RX)
LCD_D4: LCD_CON.25 U1.D16(PD4/LCD_D4/UART2_CTS)
LCD_D5: LCD_CON.26 U1.C16(PD5/LCD_D5/UART2_RTS)
LCD_D6: LCD_CON.27 U1.B16(PD6/LCD_D6/ECRS)
LCD_D7: LCD_CON.28 U1.A16(PD7/LCD_D7/ECOL)
LCD_D8: LCD_CON.13 U1.C17(PD8/LCD_D8)
LCD_D9: LCD_CON.14 U1.B17(PD9/LCD_D9)
LCD_D10: LCD_CON.15 U1.A17(PD10/LCD_D10/ERXDO)
LCD_D11: LCD_CON.16 U1.C18(PD11/LCD_D11/ERXD1)
LCD_D12: LCD_CON.17 U1.B18(PD12/LCD_D12/ERXD2)
LCD_D13: LCD_CON.18 U1.A18(PD13/LCD_D13/ERXD3)
LCD_D14: LCD_CON.19 U1.A19(PD14/LCD_D14/ERXCK)
LCD_D15: LCD_CON.20 U1.A20(PD15/LCD_D15/ERXERR)
LCD_D16: LCD_CON.5 U1.B19(PD16/LCD_D16)
LCD_D17: LCD_CON.6 U1.B20(PD17/LCD_D17)
LCD_D18: LCD_CON.7 U1.D17(PD18/LCD_D18/ERXDV)
LCD_D19: LCD_CON.8 U1.D18(PD19/LCD_D19/ETXD0)
LCD_D20: LCD_CON.9 U1.E17(PD20/LCD_D20/ETXD1)
LCD_D21: LCD_CON.10 U1.E18(PD21/LCD_D21/ETXD2)
LCD_D22: LCD_CON.11 U1.F17(PD22/LCD_D22/ETXD3)
LCD_D23: LCD_CON.12 U1.F18(PD23/LCD_D23/ETXEN)
LCD_DE: LCD_CON.32 U1.G18(PD25/LCD_DE/ETXERR)
LCD_HSYNC: LCD_CON.29 U1.H17(PD26/LCD_HSYNC/EMDC)
LCD_PWR: LCD_CON.35 U1.F2(PB9/SPDIF_DI/I2S_DI/EINT23)
LCD_VSYNC: LCD_CON.30 U1.H18(PD27/LCD_VSYNC/EMDIO)
LDO0-OUT: 5V/LDO0.2 C102.1 C107.1 C109.1 C112.1 C118.1 C125.1 U11.4(VIN2) U11.12(VIN3) U11.19(ALDOIN) U11.28(VIN4) U11.38(VIN1)
LINEINL: C123.2 U1.U17(LINEINL)
LINEINR: C122.2 U1.V18(LINEINR)
LRADC0: GPIO-2.11 R18.1 U1.Y17(LRADC0)
LRADC1: GPIO-2.12 U1.Y18(LRADC1)
MIC1OUTN: MIC/TV.1 U1.W18(MIC1OUTN)
MIC1OUTP: MIC/TV.2 U1.W17(MIC1OUTP)
MICIN1: MIC/TV.6 U1.Y15(MICIN1)
MICIN2: MIC/TV.8 U1.W15(MICIN2)
MICM: C77.1 MIC/TV.7 R24.2(1.2)
N$1: R22.1 U1.V17(PLLTEST)
N$2: HVREG1.1(PP) U1.U18(HVREG1)
N$3: R8.2 U2.H8(ZQ)
N$4: HVREG2.1(PP) U1.U19(HVREG2)
N$5: R10.2 U3.H8(ZQ)
N$6: R14.2 U4.28(RTSET)
N$7: HPBP.1(PP) U1.U14(HPBP)
N$8: C121.1 U11.15(VINT) U11.23(PWREN)
N$9: C122.1 LINE_IN.3
N$10: 3.0VA_E.1 C108.1 U11.22(ALDO1)
N$11: C66.2 U1.T16(V33_PLL)
N$12: RM1.3.1 U4.15(LED4/PHYAD4)
N$13: C123.1 LINE_IN.2
N$14: POWER.P$1 R54.2
N$15: C126.1 U11.9(DLDO2)
N$16: PWR_LED.C T1.3(C)
N$17: PWR_LED.A R55.2
N$18: C120.1 U11.20(VREF)
N$19: FET1.1(G) PWR.-- R53.1
N$20: 5V/LDO0.1 U11.32(LDO0)
N$22: AUDIO_OUT.5 L16.2
N$23: C103.1 U11.8(DLDO1)
N$25: AUDIO_OUT.2 L15.2
N$26: AUDIO_OUT.3 L13.2
N$27: C92.2 D1.C U1.P16(V33_USB)
N$32: C69.2 R16.2 RM1.2.2 U4.42(RESETB)
N$33: C73.2 RM3.1.1 RM3.2.1
N$34: C115.2 RM6.1.1
N$35: C119.2 RM6.2.1
N$39: LAN.1(TD+) RM3.4.2 U4.34(TPTX+)
N$40: LAN.2(TD-) RM3.3.2 U4.33(TPTX-)
N$41: LAN.7(RD+) RM3.2.2 U4.31(TPRX+)
N$44: C114.2 RM6.3.1
N$45: LAN.8(RD-) RM3.1.2 U4.30(TPRX-)
N$47: C72.2 RM3.3.1 RM3.4.1
N$48: L10.1 U11.37(LX1)
N$49: RM2.2.2 U4.10(LED1/PHYAD1)
N$51: RM2.3.2 U4.12(LED2/PHYAD2)
N$53: LAN.KG R15.1
N$54: LAN.AY RM2.4.2 U4.13(LED3/PHYAD3)
N$55: C63.1 L3.1 U4.8(PWFBIN)
N$56: C64.1 C65.1 C70.2 L3.2 LAN.3(COM) U4.32(PWFBOUT)
N$57: LAN.KY R17.1
N$58: R23.1 SD/MMC1.12(PACK)
N$63 [PWR]: 3.3V_E.1 C100.1 C101.1 L10.2 U11.39(DCDC1)
N$64: C99.1 R48.1
N$68: R15.2 RM2.1.2 U4.9(LED0/PHYAD0)
N$69: L11.1 U11.5(LX2)
N$70 [PWR]: 1.2V_CPU_E.1 C105.1 C106.1 L11.2 U11.7(DCDC2)
N$71: L12.1 U11.13(LX3)
N$72 [PWR]: 1.5V_E.1 C110.1 C111.1 L12.2 U11.11(DCDC3)
N$74: L14.1 U11.27(LX4)
N$75 [PWR]: 1.2V_INT_E.1 C116.1 C117.1 L14.2 U11.25(DCDC4)
N$88: BOOT/REC.P$2 R45.2 UBOOT/REC.2
N$99: R34.2 U9.3(ISET)
N$100: C86.+ L6.2 R32.2 U9.1(OUT)
N$101: R37.2 U10.3(ISET)
N$110: L9.2 USB_HOST.P$3 USB_HOST.P$4
N$111: C96.1 L8.2 USB_HOST.1
N$122: C81.2 C82.2 U1.W14(VRP)
N$133: C77.2 U1.V15(VRA1)
N$161: R31.1 SD/MMC2.CD(CP)
N$176: C78.2 C79.2 R28.1 U1.V14(VRA2)
N$192: C94.+ L8.1 U10.1(OUT)
N$229: LCD_CON.33 R38.1
N$230: LCD_CON.34 R39.1
N$231: LED1.A R49.2
N$266: L7.2 USB_OTG.GND1 USB_OTG.GND2 USB_OTG.GND3 USB_OTG.GND4
NMI_N: GPIO-3.6 R50.1 U1.B9(NMI_N) U11.31(IRQ)
PIN0: GPIO-3.7 U11.40(GPIO0)
PIN1: GPIO-3.9 U11.1(GPIO1)
PIN2: GPIO-3.10 U11.24(GPIO2)
PIN3: GPIO-3.8 U1.H20(PE0/TS_CLK/CSI_PCLK/SPI2_CS0/EINT14)
PIN4/TWI0-SCK: GPIO-1.5 R51.1 U1.L20(PB0/TWI0_SCK) U11.35(SCK)
PIN5/TWI0-SDA: GPIO-1.7 R52.1 U1.L19(PB1/TWI0_SDA) U11.34(SDA)
PIN6/PWM0: GPIO-1.9 LCD_CON.36 U1.K20(PB2/PWM0/SPDIF_DO/EINT16)
PIN7: GPIO-1.11 R38.2 U1.A14(PB3/IR_TX/EINT17)
PIN8: GPIO-1.13 R39.2 U1.K19(PB4/IR_RX/EINT18)
PIN9: GPIO-1.15 U1.B6(PC17/NCE2/UART3_RX)
PIN10/TWI1-SCK: GPIO-1.17 GPIO-2.5 R12.2 U1.J20(PB15/TWI1_SCK) U5.6(SCL)
PIN11/TWI1-SDA: GPIO-1.19 GPIO-2.6 R13.1 U1.J19(PB16/TWI1_SDA) U5.5(SDA)
PIN12/NWE: GPIO-1.21 U1.D1(PC0/NWE/SPI0_MOSI)
PIN13/NALE: GPIO-1.23 U1.C3(PC1/NALE/SPI0_MISO)
PIN14/NCLE: GPIO-1.25 U1.C2(PC2/NCLE/SPI0_CLK)
PIN15/NCE1: GPIO-1.27 U1.C1(PC3/NCE1/SPI0_CS0)
PIN16/NCE0: GPIO-1.29 U1.B2(PC4/NCE0)
PIN17/NRE: GPIO-1.31 U1.B1(PC5/NRE)
PIN18/NRB0: GPIO-1.33 U1.A1(PC6/NRB0/SDC2_CMD)
PIN19/NRB1: GPIO-1.35 U1.A2(PC7/NRB1/SDC2_CLK)
PIN20/NDQ0: GPIO-1.37 U1.B3(PC8/NDQ0/SDC2_D0)
PIN21/NDQ1: GPIO-1.39 U1.A3(PC9/NDQ1/SDC2_D1)
PIN22/NDQ2: GPIO-1.40 U1.C4(PC10/NDQ2/SDC2_D2)
PIN23/NDQ3: GPIO-1.38 U1.B4(PC11/NDQ3/SDC2_D3)
PIN24/NDQ4: GPIO-1.36 U1.A4(PC12/NDQ4/SDC2_D4)
PIN25/NDQ5: GPIO-1.34 U1.D5(PC13/NDQ5/SDC2_D5)
PIN26/NDQ6: GPIO-1.32 U1.C5(PC14/NDQ6/SDC2_D6)
PIN27/NDQ7: GPIO-1.30 U1.B5(PC15/NDQ7/SDC2_D7)
PIN28/NWP: GPIO-1.28 U1.A5(PC16/NWP/UART3_TX)
PIN29: GPIO-1.26 U1.F20(PE4/TS_D0/CSI_D0/SDC2_DO)
PIN30: GPIO-1.24 U1.F19(PE5/TS_D1/CSI_D1/SDC2_D1)
PIN31: GPIO-1.22 U1.E20(PE6/TS_D2/CSI_D2/SDC2_D2)
PIN32: GPIO-1.20 U1.E19(PE7/TS_D3/CSI_D3/SDC2_D3)
PIN33: GPIO-1.18 U1.D20(PE8/TS_D4/CSI_D4/SDC2_CMD)
PIN34: GPIO-1.16 U1.D19(PE9/TS_D5/CSI_D5/SDC2_CLK)
PIN35: GPIO-1.14 U1.C20(PE10/TS_D6/CSI_D6/UART1_TX)
PIN36: GPIO-1.12 U1.C19(PE11/TS_D7/CSI_D7/UART1_RX)
PIN37/LED1 [PWR]: GPIO-1.10 R49.1 U1.G19(PE3/TS_DVLD/CSI_VSYNC/SPI2_MISO)
PIN38: GPIO-1.8 U1.G20(PE2/TS_SYNC/CSI_HSYNC/SPI2_MOSI)
PIN39 [PWR]: GPIO-1.6 U1.H19(PE1/TS_ERR/CSI_MCLK/SPI2_CLK/EINT15)
PIN40/UART3-TX: GPIO-2.3 U1.G1(PG9/SPI1_CS0/UART3_TX/EINT9)
PIN41/UART3-RX: GPIO-2.4 U1.G2(PG10/SPI1_CLK/UART3_RX/EINT10)
PIN42: GPIO-2.7 U1.D2(PB5/I2S_MCLK/EINT19)
PIN43: GPIO-2.8 U1.E1(PB6/I2S_BCLK/EINT20)
PIN44: GPIO-2.9 U1.E2(PB7/I2S_LRCK/EINT21)
PIN45: GPIO-2.10 U1.F1(PB8/I2S_DO/EINT22)
PWRON: C124.1 R54.1 U11.2(PWRON)
RASN: U1.U4(SRAS/DDR2_A11/DDR3_RAS) U2.F3(#RAS) U3.F3(#RAS)
RECOVERY: U1.B11(PG2/GPS_MAG/EINT2) UBOOT/REC.3
RESET_N: C75.2 GPIO-3.5 JTAG-DEBUG.8 R21.1 T1.1(B) U1.A8(RESET_N) U11.33(PWROK)
RTC-VCC: C113.1 R50.2 U11.18(RTC31)
SD0-CLK: SD/MMC1.5(CLK/SCLK) U1.K18(PF2/SDC0_CLK/UART0_TX)
SD0-CMD: R20.1 SD/MMC1.3(CMD/DI) U1.K17(PF3/SDC0_CMD/JTAG_DO1)
SD0-D0: RM4.2.1 SD/MMC1.7(DAT0/DO) U1.L17(PF1/SDC0_D0/JTAG_DI1)
SD0-D1: RM4.3.1 SD/MMC1.8(DAT1/RES) U1.L18(PF0/SDC0_D1/JTAG_MS1)
SD0-D2: RM4.1.1 SD/MMC1.1(DAT2/RES) U1.J17(PF5/SDC0_D2/JTAG_CK1)
SD0-D3: R19.1 SD/MMC1.2(CD/DAT3/CS) U1.J18(PF4/SDC0_D3/UART0_RX)
SD0-DET#: RM4.4.2 SD/MMC1.10(CP_E) U1.A10(PG1/GPS_SIGN/EINT1)
SD1-CLK: SD/MMC2.5(CLK/SCLK) U1.B12(PG4/SDC1_CLK/MS_CLK/UART1_RX/EINT4)
SD1-CMD: R27.1 SD/MMC2.2(CMD/DI) U1.A11(PG3/SDC1_CMD/MS_BS/UART1_TX/EINT3)
SD1-D0: RM5.2.1 SD/MMC2.7(DAT0/DO) U1.A12(PG5/SDC1_D0/MS_D0/UART1_CTS/EINT5)
SD1-D1: RM5.3.1 SD/MMC2.8(DAT1/RES) U1.B13(PG6/SDC1_D1/MS_D1/UART1_RTS/UART2_RTS/EINT6)
SD1-D2: RM5.1.1 SD/MMC2.9(DAT2/RES) U1.A13(PG7/SDC1_D2/MS_D2/UART2_TX/EINT7)
SD1-D3: R25.1 SD/MMC2.1(CD/DAT3/CS) U1.B14(PG8/SDC1_D3/MS_D3/UART2_RX/EINT8)
SD1-DET#: R31.2 RM5.4.1 U1.H3(PG13/SPI1_CS1/PWM1/UART2_CTS/EINT13)
SD_VCC: C74.2 C76.2 L4.2 SD/MMC1.4(VDD)
SD_VCC1: C80.2 C83.2 L5.2 SD/MMC2.4(VDD)
SPI2-CLK/JTAG_CKO: JTAG-DEBUG.3 U1.E4(PB12/SPI2_CLK/JTAG_CK0/EINT26) UEXT.9
SPI2-CS0/JTAG_MS0: JTAG-DEBUG.2 R44.1 U1.E3(PB11/SPI2_CS0/JTAG_MS0/EINT25) UEXT.10
SPI2-MISO/JTAG_DI0: JTAG-DEBUG.5 U1.F4(PB14/SPI2_MISO/JTAG_DI0/EINT28) UEXT.7
SPI2-MOSI/JTAG_DO0: JTAG-DEBUG.4 U1.F3(PB13/SPI2_MOSI/JTAG_DO0/EINT27) UEXT.8
SVREF: C8.2 C9.2 C49.2 C50.2 R1.1 R3.2 R4.2 U1.L4(SVREF0) U1.U11(SVREF1)
TPX1: C89.2 LCD_CON.37 U1.Y20(TPX1)
TPX2: C90.2 LCD_CON.38 U1.Y19(TPX2)
TPY1: C91.2 LCD_CON.39 U1.W20(TPY1)
TPY2: C93.2 LCD_CON.40 U1.W19(TPY2)
TVOUT: MIC/TV.9 U1.M18(TVOUT)
TWI2-SCK: R42.1 U1.A7(PB17/TWI2_SCK) UEXT.5
TWI2-SDA: R43.1 U1.B8(PB18/TWI2_SDA) UEXT.6
UART0-RX: U1.G4(PB20/UART0_RX/EINT30) UART1.3
UART0-TX: U1.G3(PB19/UART0_TX/EINT29) UART1.2
UART2-RX: U1.B7(PC19/NDQS/UART2_RX/UART3_RTS) UEXT.4
UART2-TX: U1.A6(PC18/NCE3/UART2_TX/UART3_CTS) UEXT.3
UBOOT: U1.A9(UBOOT_N) UBOOT/REC.1
UDM0: U1.P18(UDM0) USB_OTG.D-
UDM1: U1.N18(UDM1) USB_HOST.2
UDP0: U1.P17(UDP0) USB_OTG.D+
UDP1: U1.N17(UDP1) USB_HOST.3
USB0-DRV: R33.2 U1.H1(PG11/SPI1_MOSI/UART3_CTS/EINT11) U9.4(EN)
USB0-IDDET: R41.2 U1.H2(PG12/SPI1_MISO/UART3_RTS/EINT12) USB_OTG.ID
USB0-VBUSDET: C85.1 R32.1 R35.2 U1.B10(PG0/GPS_CLK/EINT0)
USB1-DRV [PWR]: R36.2 U1.D3(PB10/SPI2_CS1/SPDIF_DO/EINT24) U10.4(EN)
V12_DLL: C10.2 C11.2 C12.2 R2.1 U1.J4(VDD_DLL) U1.J5(VDD_DLL)
V33_HDMI: C97.1 C98.2 R40.2 U1.R16(V33_HDMI)
V+: 1.5V.1(PP) 1.5V_E.2 C1.2 C2.2 C3.2 C4.2 C5.2 C6.2 C7.2 C8.1 C22.1 C24.2 C25.2 C26.2 C27.2 C28.2 C29.2 C32.2 C33.2 C34.2 C35.2 C36.2 C37.2 R1.2 R5.2 U1.M5(VCC_DRAM) U1.N5(VCC_DRAM) U1.T5(VCC_DRAM) U1.T6(VCC_DRAM) U1.T9(VCC_DRAM) U1.T10(VCC_DRAM) U1.T11(VCC_DRAM) U2.A2(VDD) U2.A9(VDD) U2.B9(VDDQ) U2.C1(VDDQ) U2.D7(VDD) U2.E2(VDDQ) U2.E9(VDDQ) U2.G2(VDD) U2.G8(VDD) U2.K1(VDD) U2.K9(VDD) U2.M1(VDD) U2.M9(VDD) U3.A2(VDD) U3.A9(VDD) U3.B9(VDDQ) U3.C1(VDDQ) U3.D7(VDD) U3.E2(VDDQ) U3.E9(VDDQ) U3.G2(VDD) U3.G8(VDD) U3.K1(VDD) U3.K9(VDD) U3.M1(VDD) U3.M9(VDD) ; supply symbol labelled 1.5V
VCC [PWR]: 3.3V.1(PP) 3.3V_E.2 C51.2 C52.2 C53.2 C54.2 C55.2 C56.2 C57.2 C84.2 C104.1 D1.A GPIO-1.3 GPIO-2.1 GPIO-3.3 JTAG-DEBUG.1 L1.2 L2.2 L4.1 L5.1 LAN.AG LCD_CON.3 R12.1 R13.2 R20.2 R21.2 R23.2 R27.2 R40.1 R41.1 R42.2 R43.2 R44.2 R45.1 R46.2 R47.2 R51.2 R52.2 R55.1 RM1.1.1 RM1.2.1 RM2.1.1 RM4.1.2 RM4.2.2 RM4.3.2 RM5.1.2 RM5.2.2 RM5.3.2 RM5.4.2 U1.E5(VCC) U1.F5(VCC) U1.G16(VCC) U1.H16(VCC) U1.J16(VCC) U1.K16(VCC) U1.L16(VCC) U1.T14(V33_HP) U4.37(ANE) U4.38(DUPLEX) U4.39(SPEED) U4.41(LDPS) U4.44(MII/SNIB) U5.8(VCC) U11.10(DLDOIN) UART1.1 UEXT.1 ; supply symbol labelled 3.3V
VCC/2: 1.2V_CPU.1(PP) 1.2V_CPU_E.2 C38.2 C39.2 C40.2 C41.2 C42.2 C43.2 C44.2 C45.2 C46.2 U1.E6(VDD_CPU) U1.E7(VDD_CPU) U1.E8(VDD_CPU) U1.E9(VDD_CPU) U1.E10(VDD_CPU) U1.E11(VDD_CPU) U1.E12(VDD_CPU) U1.E13(VDD_CPU) U1.E14(VDD_CPU) ; supply symbol labelled 1.2V_CPU
VCCINT: 1.2V_INT.1(PP) 1.2V_INT_E.2 C13.2 C14.2 C15.2 C16.2 C17.2 C18.2 C19.2 C20.2 C21.2 R2.2 U1.E15(VDD_CORE) U1.E16(VDD_CORE) U1.F16(VDD_CORE) U1.H4(VDD_CORE) U1.H5(VDD_CORE) U1.M16(VDD_CORE) U1.M17(VDD_CORE) U1.T13(VDD_CORE) U1.U13(VDD_CORE) ; supply symbol labelled 1.2V_INT
VMIC: MIC/TV.5 U1.Y16(VMIC)
VPP [PWR]: 3.0VA.1(PP) 3.0VA_E.2 C71.2 GPIO-2.13 R18.2 U1.T15(AVCC) ; supply symbol labelled 3.0VA
WEN: U1.V3(SWE/DDR2_CKE0/DDR3_WE) U2.H3(#WE) U3.H3(#WE)
XTALI: C67.2 Q2.2 U1.U20(X24MIN)
XTALI1: C61.2 Q1.2 U4.46(X1)
XTALO: C68.2 Q2.1 U1.V20(X24MOUT)
XTALO1: C62.2 Q1.1 U4.47(X2)
Unconnected: AUDIO_OUT.1 AUDIO_OUT.4 HDMI.14 LAN.6(NC) LINE_IN.1 LINE_IN.4 RM1.4.1 RM1.4.2 RM6.4.1 RM6.4.2 U1.M4(SODT1/DDR2_ODT1/DDR3_ODT1) U1.U5(SCKE1/DDR2_CKE1/DDR3_CKE1) U1.V12(SDQ19/DDR2_D16/DDR3_D19) U1.W3(SDQ22/DDR2_D19/DDR3_D22) U1.W4(SDQ16/DDR2_D22/DDR3_D16) U1.W5(SDQ29/DDR2_D25/DDR3_D29) U1.W6(SDQ25/DDR2_D27/DDR3_D25) U1.W7(SDQS2/DDR2_DQS2/DDR3_DQS2) U1.W8(SDQM2/DDR2_DM2/DDR3_DM2) U1.W9(SDQS3/DDR2_DQS3/DDR3_DQS3) U1.W10(SDQ28/DDR2_D31/DDR3_D28) U1.W11(SDQ30/DDR2_D26/DDR3_D30) U1.W12(SDQ21/DDR2_D21/DDR3_D21) U1.Y2(SDQ20/DDR2_D20/DDR3_D20) U1.Y3(SDQ18/DDR2_D17/DDR3_D18) U1.Y4(SDQ27/DDR2_D28/DDR3_D27) U1.Y5(SDQ31/DDR2_D30/DDR3_D31) U1.Y6(SDQM3/DDR2_DM3/DDR3_DM3) U1.Y7(SDQS2_N/DDR2_DQS2_N/DDR3_DQS2_N) U1.Y8(SDQ24/DDR2_D24/DDR3_D24) U1.Y9(SDQS3_N/DDR2_DQS3_N/DDR3_DQS3_N) U1.Y10(SDQ26/DDR2_D29/DDR3_D26) U1.Y11(SDQ17/DDR2_D23/DDR3_D17) U1.Y12(SDQ23/DDR2_D18/DDR3_D23) U2.A3(NC) U2.A7(NF/#TDQS) U2.F1(NC) U2.F9(NC) U2.H9(NC) U2.J7(NC) U3.A3(NC) U3.A7(NF/#TDQS) U3.F1(NC) U3.F9(NC) U3.H9(NC) U3.J7(NC) U4.27(NC) U11.16(N_RSTO) U11.17(RTC13) U11.21(ALDO2)

## Buses
LCD_D[0..7],LCD_D[8..15],LCD_D[16..23],LCD_HSYNC,LCD_VSYNC,LCD_CLK,LCD_DE
ETXD[0..3],ETXEN,ETXCK,ERXD[0..3],ERXDV,ERXCK,ERXERR,EMDC,EMDIO,ECOL,ECRS,EPHY-RST#
VMIC,MICIN1,MICM,MICIN2,HPOUTL,HPCOM,HPOUTR,LINEINR,LINEINL,TVOUT
HTX0P,HTX0N,HTX1P,HTX1N,HTX2P,HTX2N,HTXCP,HTXCN,HSCL,HSDA,HHPD,HCEC
D[0..15]
BA[0..2],CLK,CLKN,CKE,DDR3_CS0,DDR3_CS1,CASN,RASN,WEN,DQM[0..3],DQS[0..3],DQS0_N,DQS1_N,DQS2_N,DQS3_N,DDR3_RST,DDR3_ODT0
A[0..14]

## Notes on the sheet
- 512Mbytes DDR3 SDRAM (256Mx2)
- Ethernet | EEPROM
- 16 Kbit
- (2048 x 8)
- MAC Address
- MicroSD | HDMI
- SD/MMC
- LCD EXTENSION | GPIO EXTENSIONs | USB-OTG
- Iset = 6800/Rs | Rs
- Iset = 523mA
- 5.0V | GND
- 3.3V | GND
- USB-HOST
- R0 | R1
- R2 | R3
- R4 | R5
- R6 | R7
- G0 | G1
- G2 | G3
- G4 | G5
- G6 | G7
- B0 | B1
- Rs
- B2 | B3
- B4 | B5
- ??? | B6 | B7
- Iset = 6800/Rs
- ??? | HSYNC | VSYNC
- Iset = 523mA
- ??? | CLK | DE
- L/R | U/D
- PWRE | BKL
- X1 | X2
- Y1 | Y2
- UEXT
- Button
- Audio In/Out, Mic & Video
- POWER SUPPLY CIRCUIT
- LEDs | Debug Interface
- +5VDC
- JTAG0-SEL JTAG1-SEL  FUNCTION
- 0         0          JTAG port mapping to PF
- 0         1          JTAG port mapping to PF
- 1         0          JTAG port mapping to PB
- 1         1          JTAG port mapping depend on software config
- Global future changes was read 21.11.2012!!!

## Library data of the parts
1.2V_CPU 1.2V_INT 1.5V 3.0VA 3.3V GND HPBP HVREG1 HVREG2 = gogo:TESTPAD: drill 40mils, diameter 70mils
1.2V_CPU_E 1.2V_INT_E 1.5V_E 3.0VA_E 3.3V_E JTAG2PB_E = jumper:SJ: SMD solder JUMPER
5V/LDO0 = jumper:SJ2W: SMD solder JUMPER
AUDIO_OUT LINE_IN = gogo:AUDIO_JACK_5PIN
BOOT/REC POWER = gogo:SW-TAKT
C1-C85 C87-C93 C95-C126 = rcl:C-EU: CAPACITOR, European symbol
C86 C94 = rcl:CPOL-EU: POLARIZED CAPACITOR, European symbol
D1 = gogo:SCHOTKKY7.62SS
D2 = OLIMEX_DISCRET:SMBJ16A
FET1 = Penko:P-MOS+DIOD
FUSE1 = gogo:FUSE
GPIO-1 LCD_CON = con-harting-ml:ML40: HARTING
GPIO-2 = con-harting-ml:ML14: HARTING
GPIO-3 UEXT = con-harting-ml:ML10: HARTING
HDMI = OLIMEX_CONNECTORS:HDMI-MC34931
JTAG-DEBUG MIC/TV = Penko:CON10
L1-L9 L13 L15 L16 = rcl:L-US: INDUCTOR, American symbol
L10-L12 L14 = OLIMEX_DISCRET:L
LAN = OLIMEX_CONNECTORS:RJLBC-060TC1_GND
LED1 PWR_LED = DOUBLE-SIDE:LED
PWR = gogo:PWR-JAK
Q1 Q2 = crystal:HC49/S: CRYSTAL
R1-R23 R25-R55 = rcl:R-EU_: RESISTOR, European symbol
R24 = OLIMEX_DISCRET:R_0R
RM1-RM6 = OLIMEX_DISCRET:R_MATRIX_4E
SD/MMC1 = OLIMEX_CONNECTORS:MICRO_SD/MMC_CP
SD/MMC2 = OLIMEX_CONNECTORS:SD_CARD
T1 = OLIMEX_DISCRET:DIGITAL_TRANSISTORS-NPN: DTC114YKA Digital Transistor - NPN
U1 = OLIMEX_IC:A10S
U2 U3 = OLIMEX_IC:H5TQ2G83CFR-H9C
U4 = OLIMEX_IC:RTL8201CP
U5 = gogo:24LCXX
U6-U8 = OLIMEX_IC:RCLAMP0524P
U9 U10 = OLIMEX_IC:SY6280
U11 = OLIMEX_IC:AXP152
U15-U17 = SparkFunEagle-6-6-07:FIDUCIAL: Fiducial Alignment Points Various fiducial points for machine vision alignment.
UART1 = Penko:CON4
UBOOT/REC = jumper:JP2E: JUMPER
USB_HOST = OLIMEX_CONNECTORS:USB_SHIELD
USB_OTG = OLIMEX_CONNECTORS:MINI_USB9

## Net classes
0 default: width 0.107 mm
1 PWR: width 0.107 mm, drill 0.076 mm, clearance 0.2 mm